# Altium schematic sheet Ethernet.SchDoc
size A3; SheetNumber: 5; SheetTotal: 9
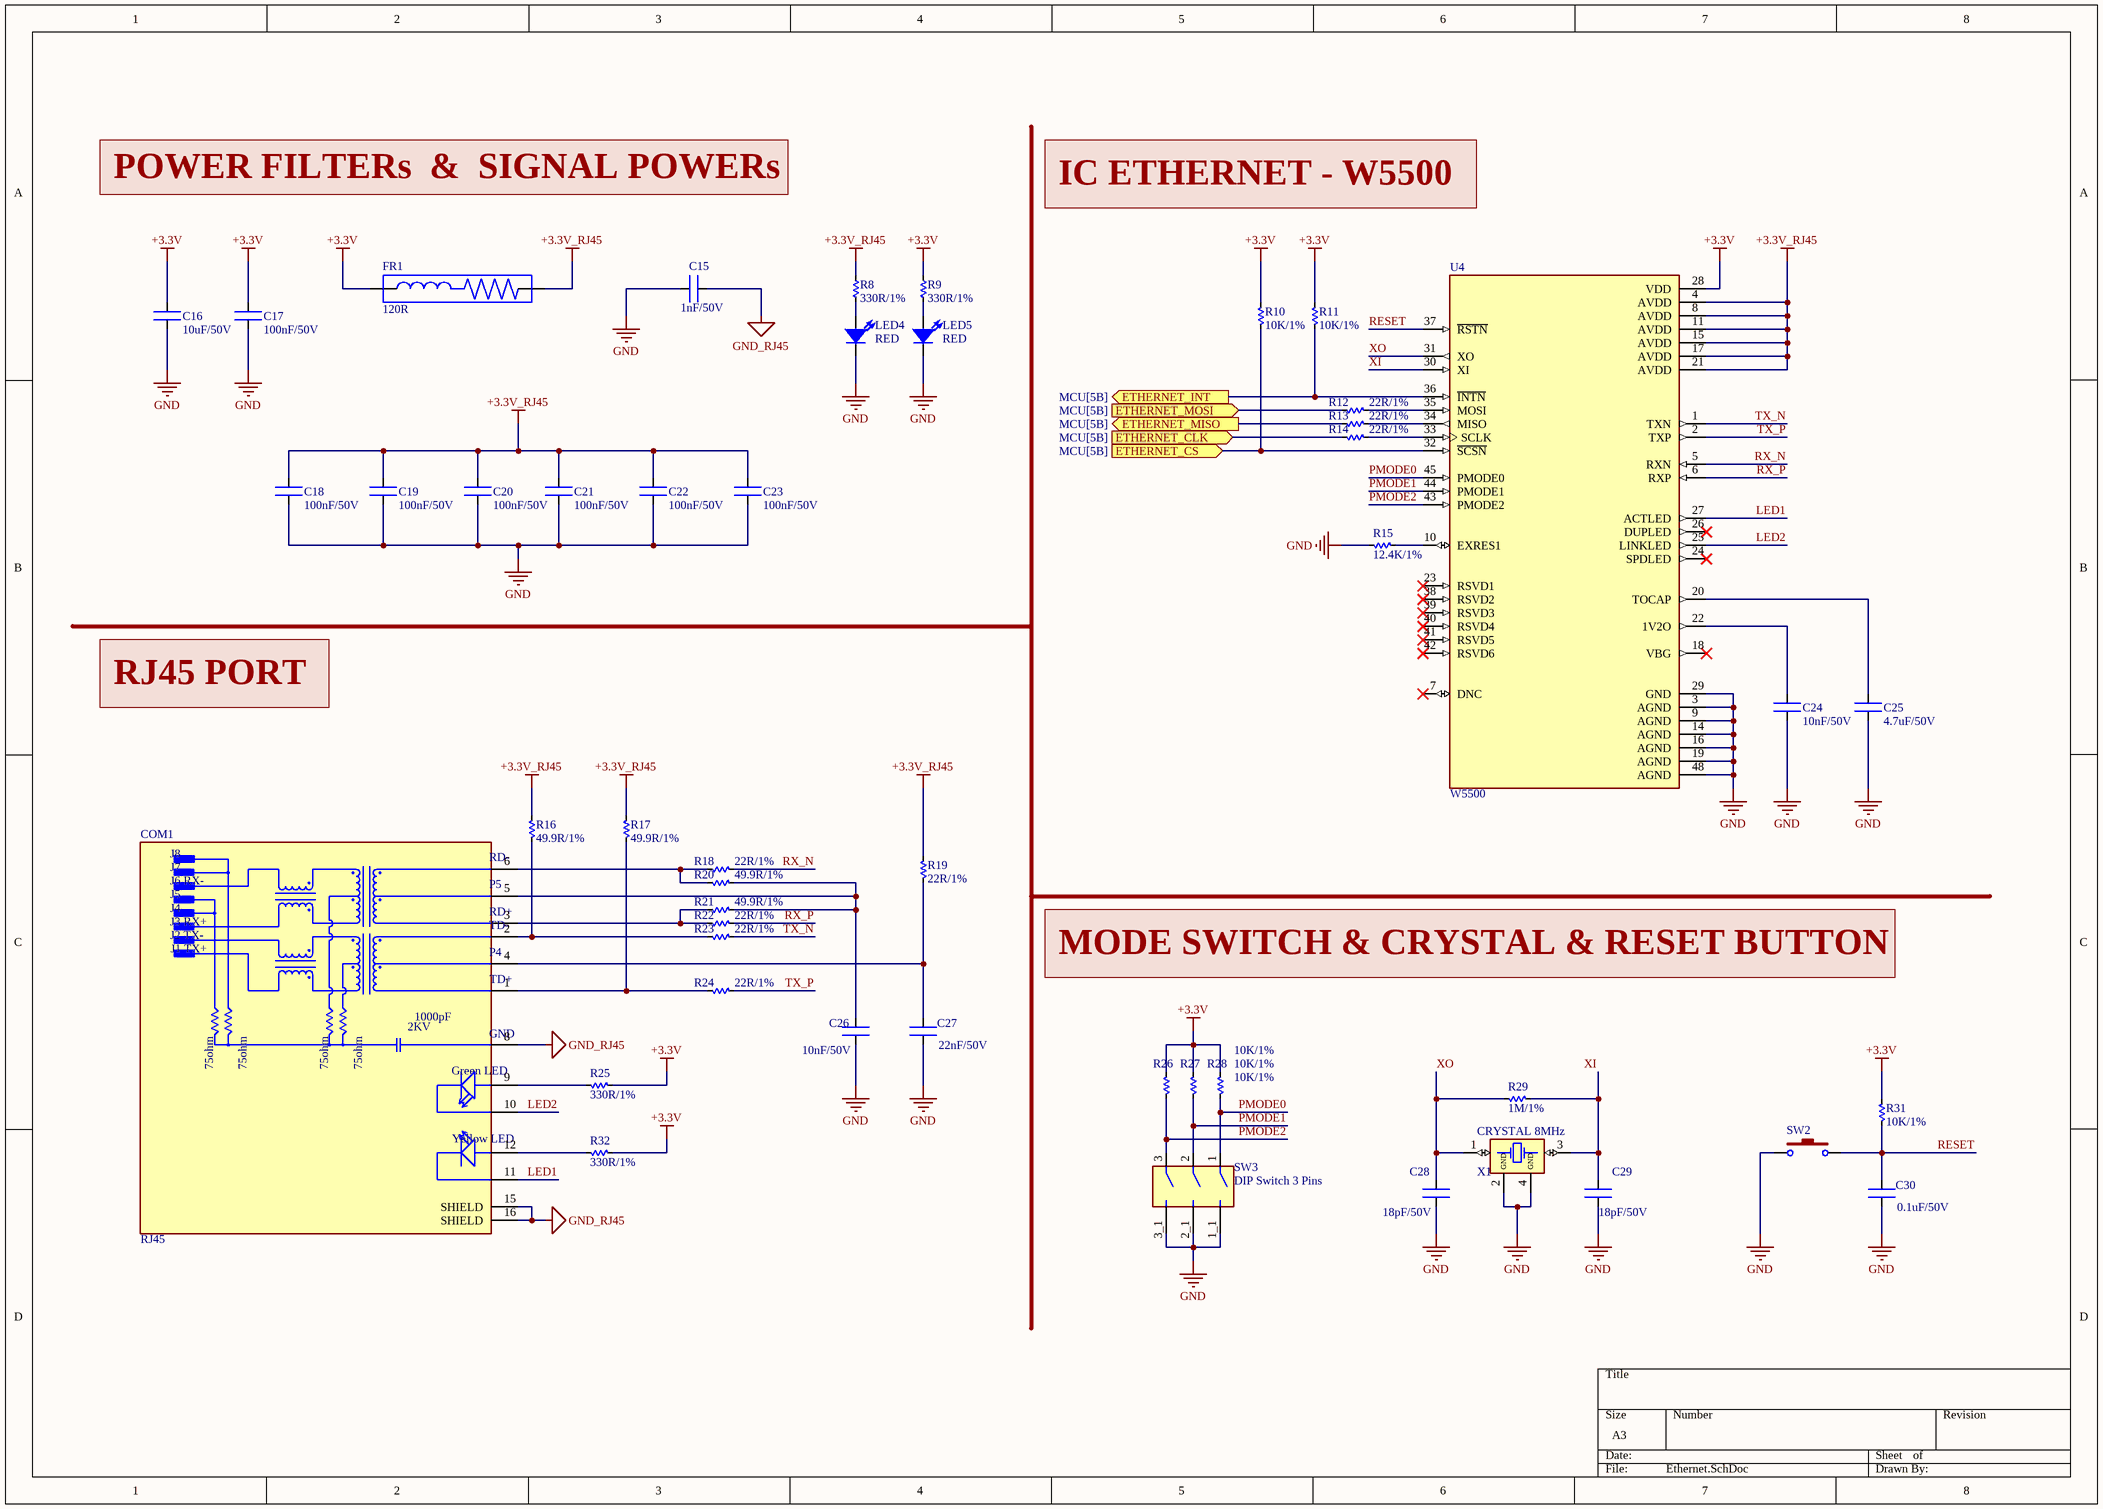
[diagram p0: Ethernet.SchDoc]

## Parts
C15  1nF/50V  [CAP - 0603]
C16  10uF/50V  [CAP - 0603]
C17  100nF/50V  [CAP - 0603]
C18  100nF/50V  [CAP - 0603]
C19  100nF/50V  [CAP - 0603]
C20  100nF/50V  [CAP - 0603]
C21  100nF/50V  [CAP - 0603]
C22  100nF/50V  [CAP - 0603]
C23  100nF/50V  [CAP - 0603]
C24  10nF/50V  [CAP - 0603]
C25  4.7uF/50V  [CAP - 0603]
C26  10nF/50V  [CAP - 0603]
C27  22nF/50V  [CAP - 0603]
C28  18pF/50V  [CAP - 0603]
C29  18pF/50V  [CAP - 0603]
C30  0.1uF/50V  [CAP - 0603]
COM1  RJ45  [RJ45]
FR1  120R  [FR-0805]
LED4  RED  [RED_LED_0603]
LED5  RED  [RED_LED_0603]
R8  330R/1%  [RES - 0603]
R9  330R/1%  [RES - 0603]
R10  10K/1%  [RES - 0603]
R11  10K/1%  [RES - 0603]
R12  22R/1%  [RES - 0603]
R13  22R/1%  [RES - 0603]
R14  22R/1%  [RES - 0603]
R15  12.4K/1%  [RES - 0603]
R16  49.9R/1%  [RES - 0603]
R17  49.9R/1%  [RES - 0603]
R18  22R/1%  [RES - 0603]
R19  22R/1%  [RES - 0603]
R20  49.9R/1%  [RES - 0603]
R21  49.9R/1%  [RES - 0603]
R22  22R/1%  [RES - 0603]
R23  22R/1%  [RES - 0603]
R24  22R/1%  [RES - 0603]
R25  330R/1%  [RES - 0603]
R26  10K/1%  [RES - 0603]
R27  10K/1%  [RES - 0603]
R28  10K/1%  [RES - 0603]
R29  1M/1%  [RES - 0603]
R31  10K/1%  [RES - 0603]
R32  330R/1%  [RES - 0603]
SW2  Button 2 Pins  [SMD SWITCH 2 PINS]  (value not drawn)
SW3  DIP Switch 3 Pins  [SMD - SW - 3Pins]
U4  W5500  [LQFP-48]
X1  CRYSTAL 8MHz  [crystal - 3.2 x 2.5 mm]

## Ports
ETHERNET_CLK (in, see MCU[5B]), ETHERNET_CS (in, see MCU[5B]), ETHERNET_INT (out, see MCU[5B]), ETHERNET_MISO (out, see MCU[5B]), ETHERNET_MOSI (in, see MCU[5B])

## Nets
+3.3V: C16.2 C17.2 FR1.1 R9.1 R10.2 R11.2 R25.1 R26.2 R27.2 R28.2 R31.1 R32.1 U4.28(VDD)
+3.3V_RJ45: C18.2 C19.2 C20.2 C21.2 C22.2 C23.2 FR1.2 R8.1 R16.2 R17.2 R19.1 U4.4(AVDD) U4.8(AVDD) U4.11(AVDD) U4.15(AVDD) U4.17(AVDD) U4.21(AVDD)
GND: C15.1 C16.1 C17.1 C18.1 C19.1 C20.1 C21.1 C22.1 C23.1 C24.1 C25.1 C26.1 C27.1 C28.1 C29.1 C30.1 LED4.2 LED5.2 R15.1 SW2.1 SW3.1_1 SW3.2_1 SW3.3_1 U4.3(AGND) U4.9(AGND) U4.14(AGND) U4.16(AGND) U4.19(AGND) U4.29(GND) U4.48(AGND) X1.2(GND) X1.4(GND)
GND_RJ45: C15.2 COM1.8(GND) COM1.15(SHIELD) COM1.16(SHIELD)
ETHERNET_CLK: R14.2 ; port ETHERNET_CLK
ETHERNET_CS: R10.1 U4.32(~{SCSN}) ; port ETHERNET_CS
ETHERNET_INT: R11.1 U4.36(~{INTN}) ; port ETHERNET_INT
ETHERNET_MISO: R13.2 ; port ETHERNET_MISO
ETHERNET_MOSI: R12.2 ; port ETHERNET_MOSI
LED1: COM1.11(YC) U4.27(ACTLED)
LED2: COM1.10(GC) U4.25(LINKLED)
PMODE0: R28.1 SW3.1 U4.45(PMODE0)
PMODE1: R27.1 SW3.2 U4.44(PMODE1)
PMODE2: R26.1 SW3.3 U4.43(PMODE2)
RESET: C30.2 R31.2 SW2.2 U4.37(~{RSTN})
RX_N: R18.1 U4.5(RXN)
RX_P: R22.1 U4.6(RXP)
TX_N: R23.1 U4.1(TXN)
TX_P: R24.1 U4.2(TXP)
XI: C29.2 R29.1 U4.30(XI) X1.3(OUT/IN)
XO: C28.2 R29.2 U4.31(XO) X1.1(IN/OUT)
NetC24_2: C24.2 U4.22(1V2O)
NetC25_2: C25.2 U4.20(TOCAP)
NetC26_2: C26.2 COM1.5(P5) R20.1 R21.1
NetC27_2: C27.2 COM1.4(P4) R19.2
NetCOM1_1: COM1.1(TD+) R17.1 R24.2
NetCOM1_2: COM1.2(TD-) R16.1 R23.2
NetCOM1_3: COM1.3(RD+) R21.2 R22.2
NetCOM1_6: COM1.6(RD-) R18.2 R20.2
NetCOM1_9: COM1.9(GA) R25.2
NetCOM1_12: COM1.12(YA) R32.2
NetLED4_1: LED4.1 R8.2
NetLED5_1: LED5.1 R9.2
NetR12_1: R12.1 U4.35(MOSI)
NetR13_1: R13.1 U4.34(MISO)
NetR14_1: R14.1 U4.33(SCLK)
NetR15_2: R15.2 U4.10(EXRES1)

Not connected (* = marked no-connect by the designer): U4 7(DNC)* 18(VBG)* 23(RSVD1)* 24(SPDLED)* 26(DUPLED)* 38(RSVD2)* 39(RSVD3)* 40(RSVD4)* 41(RSVD5)* 42(RSVD6)*

## Notes on the sheet
- POWER FILTERs  &  SIGNAL POWERs
- IC ETHERNET - W5500
- RJ45 PORT
- MODE SWITCH & CRYSTAL & RESET BUTTON
- (in symbol RJ45) J8; J7; J6 RX-; J5; J4; J3 RX+; J2 TX-; J1 TX+; 1000pF; 75ohm; 2KV; Green LED; Yellow LED

## Library data of the parts
C15-C30 = CAPACITOR: CAPACITOR SMD - KEMET
COM1 = RJ45: HR911105A
FR1 = Ferrite Beads: SMD
LED4 LED5 = LED_SMD: LED SMD
R8-R29 R31 R32 = RESISTOR: Resistor SMD - YAGEO
SW2 = Button 2 Pins: SMD Button; Supplier 1: Newark; Supplier Part Number 1: 35AH5160
SW3 = DIP Switch 3 Pins: Switch DIP ON OFF SPST 3 Flush Slide 0.1A 20VDC Gull Wing 2000Cycles 2.54mm SMD T/R
U4 = W5500: Hardwired TCP/IP embedded Ethernet controller
X1 = CRYSTAL 8MHz: SMD CRYSTAL; Supplier 1: Avnet; Supplier Part Number 1: ECS-80-8-33Q-ADS